# Altium schematic sheet Conectores.SchDoc: PLACA POTÊNCIA REVISÃO C
size A3; DocumentNumber: GA0049; SheetNumber: 2; SheetTotal: 4
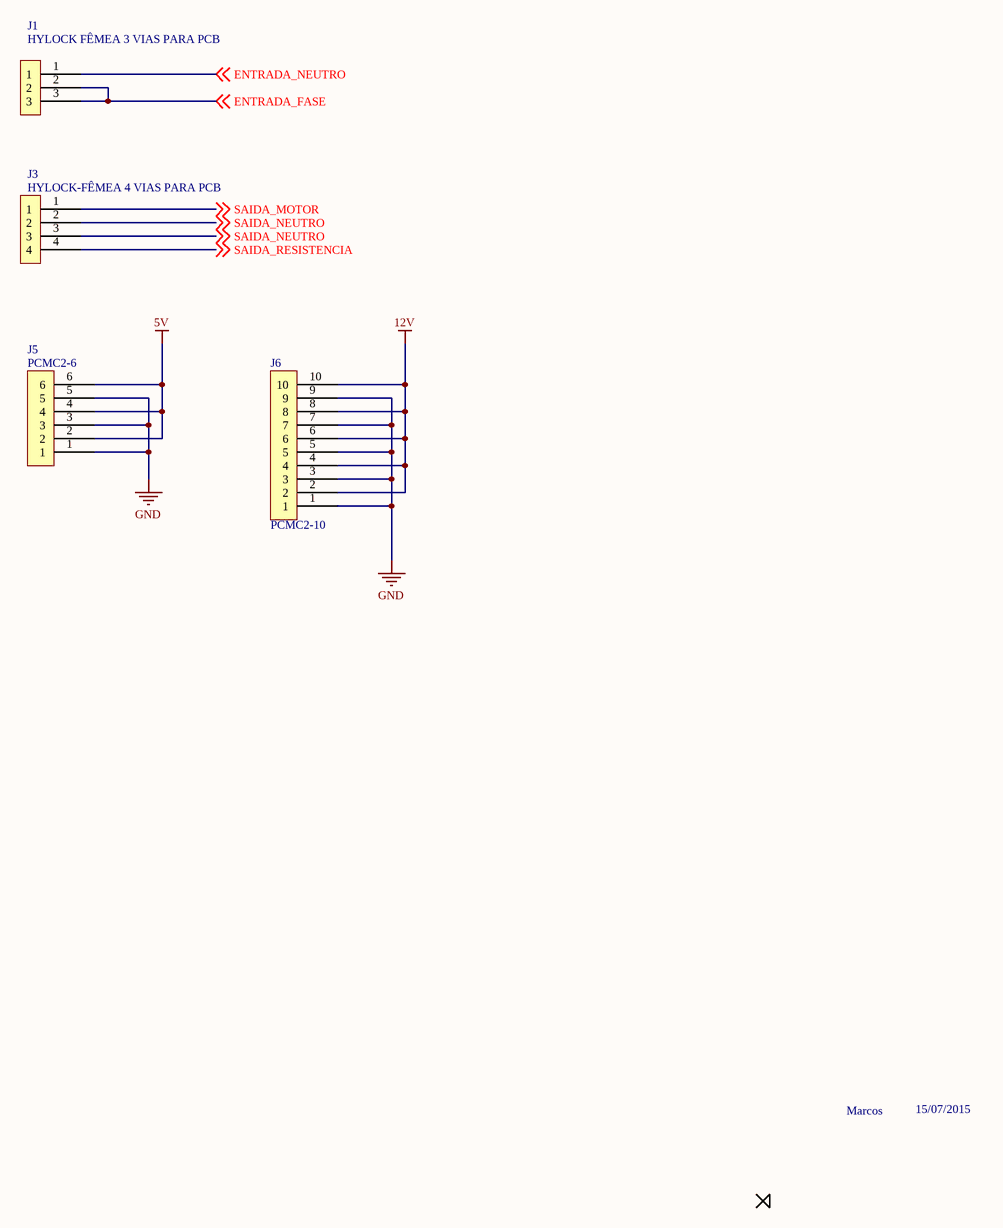
[diagram p0: Conectores.SchDoc]

## Parts
J1  HYLOCK FÊMEA 3 VIAS PARA PCB  [CONECTOR HYLOCK 3 VIAS]
J3  HYLOCK-FÊMEA 4 VIAS PARA PCB  [CONECTOR HYLOK 4 VIAS]
J5  PCMC2-6  [PCMC2-6]
J6  PCMC2-10  [PCMC2-10]

## Nets
5V: J5.2 J5.4 J5.6
12V: J6.2 J6.4 J6.6 J6.8 J6.10
GND: J5.1 J5.3 J5.5 J6.1 J6.3 J6.5 J6.7 J6.9
ENTRADA_FASE: J1.2 J1.3 ; off-sheet ENTRADA_FASE
ENTRADA_NEUTRO: J1.1 ; off-sheet ENTRADA_NEUTRO
SAIDA_MOTOR: J3.1 ; off-sheet SAIDA_MOTOR
SAIDA_NEUTRO: J3.2 J3.3 ; off-sheet SAIDA_NEUTRO
SAIDA_RESISTENCIA: J3.4 ; off-sheet SAIDA_RESISTENCIA

## Notes on the sheet
- Marcos
- 15/07/2015
- NOME
- DATA
- PROJETO
- DESCRIÇÃO
- www.quarktee.com.br
- desenho
- verif.
- aprov.
- TAMANHO
- CODIGO
- Todas as informações disponíveis
- não devem ser divulgadas,
- em parte ou todo.
- CIRCUITO IMPRESSO
- MONTAGEM ELETRÔNICA
- A4
- de

## Library data of the parts
J1 = PCMC2-3
J3 = PCMC2-4